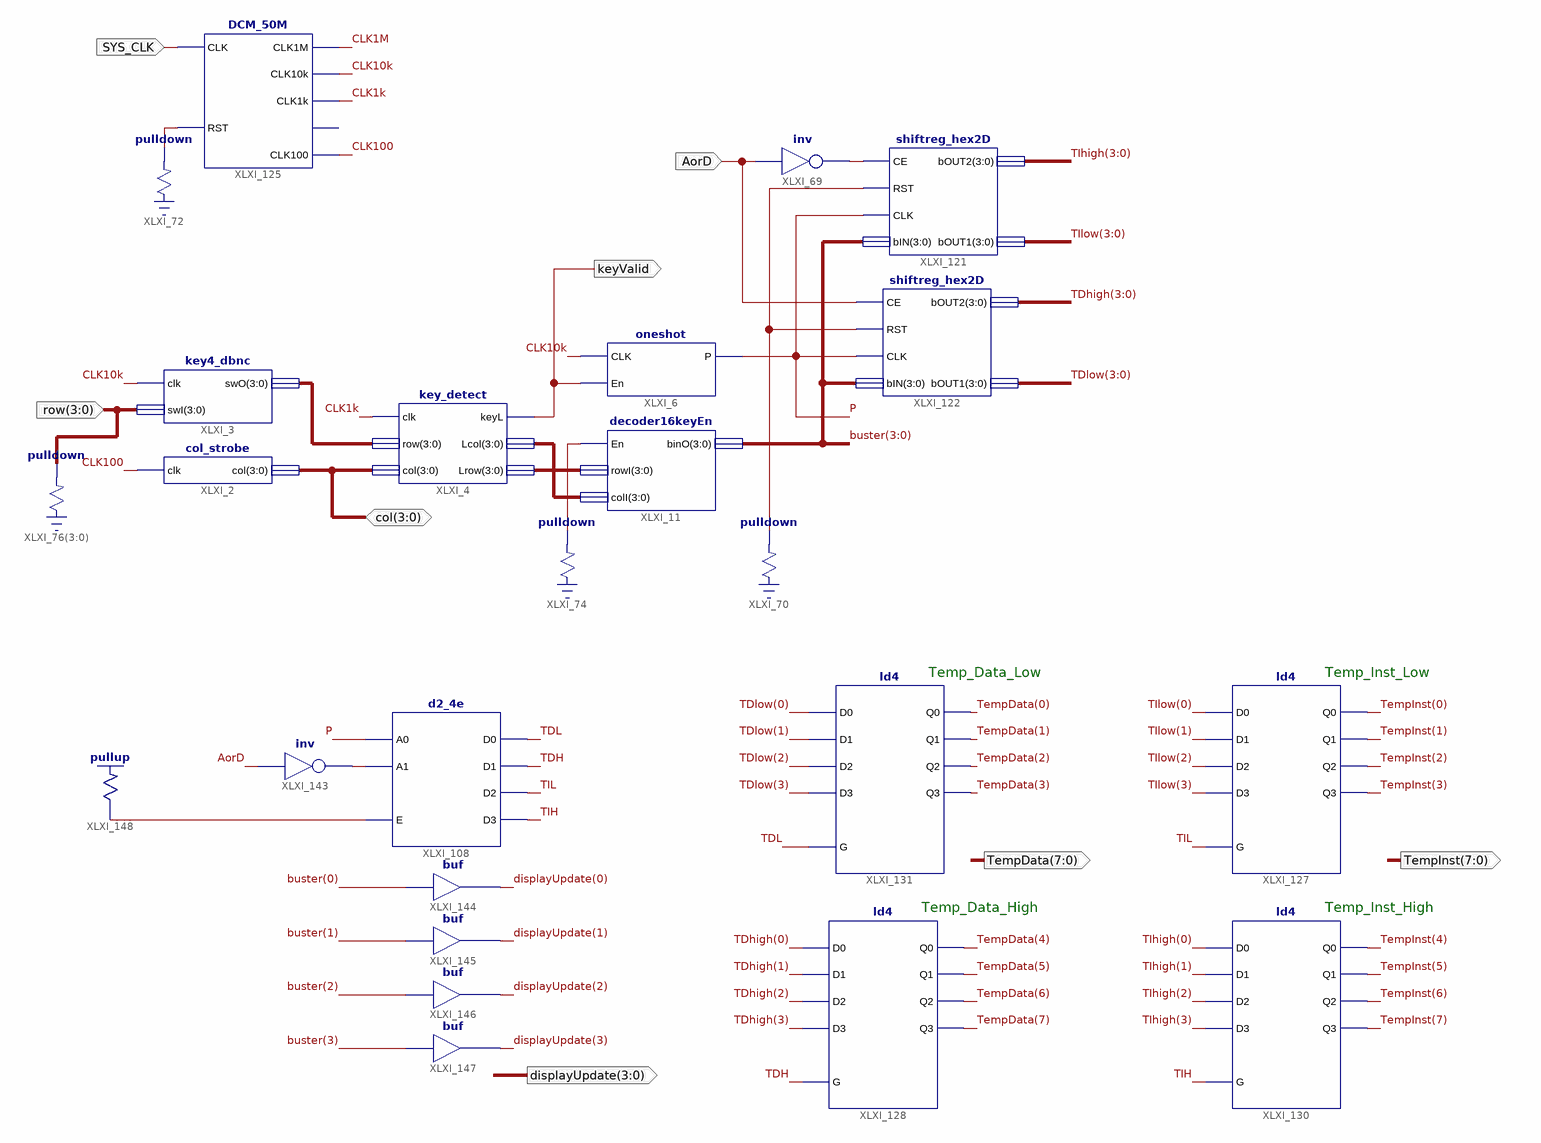
[diagram p0: schematic sheet 1]
// Xilinx ISE schematic KeypadInput.sch (spartan3e) as structural Verilog: 24 symbols, 8 ports
module KeypadInput (
  input  SYS_CLK,
  input  [3:0] row,
  input  AorD,
  inout  [3:0] col,
  output keyValid,
  output [7:0] TempInst,
  output [7:0] TempData,
  output [3:0] displayUpdate
);

  wire CLK1k, CLK1M, CLK10k, CLK100, P, TDH, TDL, TIH, TIL, XLXN_114, XLXN_115, XLXN_128, XLXN_132, XLXN_259,
       XLXN_346;
  wire [3:0] buster, TDhigh, TDlow, TIhigh, TIlow, XLXN_5, XLXN_6, XLXN_170;

  key_detect XLXI_4 (.clk(CLK1k), .row(XLXN_170), .col(col), .keyL(keyValid), .Lcol(XLXN_6), .Lrow(XLXN_5));
  decoder16keyEn XLXI_11 (.En(XLXN_132), .rowI(XLXN_5), .colI(XLXN_6), .binO(buster));
  oneshot XLXI_6 (.CLK(CLK10k), .En(keyValid), .P(P));
  \pulldown  XLXI_74 (.O(XLXN_132));
  key4_dbnc XLXI_3 (.clk(CLK10k), .swI(row), .swO(XLXN_170));
  \pulldown  XLXI_76[3:0] (.O(row));
  col_strobe XLXI_2 (.clk(CLK100), .col(col));
  \pulldown  XLXI_72 (.O(XLXN_128));
  \pulldown  XLXI_70 (.O(XLXN_115));
  not XLXI_69 (XLXN_114, AorD);
  shiftreg_hex2D XLXI_121 (.CE(XLXN_114), .RST(XLXN_115), .CLK(P), .bIN(buster), .bOUT2(TIhigh), .bOUT1(TIlow));
  shiftreg_hex2D XLXI_122 (.CE(AorD), .RST(XLXN_115), .CLK(P), .bIN(buster), .bOUT2(TDhigh), .bOUT1(TDlow));
  DCM_50M XLXI_125 (
    .CLK(SYS_CLK), .RST(XLXN_128), .CLK1M(CLK1M), .CLK10k(CLK10k), .CLK1k(CLK1k), .CLK100(CLK100));  // open: CLK1
  ld4 XLXI_127 (
    .D0(TIlow[0]), .D1(TIlow[1]), .D2(TIlow[2]), .D3(TIlow[3]), .G(TIL), .Q0(TempInst[0]), .Q1(TempInst[1]),
    .Q2(TempInst[2]), .Q3(TempInst[3]));
  ld4 XLXI_130 (
    .D0(TIhigh[0]), .D1(TIhigh[1]), .D2(TIhigh[2]), .D3(TIhigh[3]), .G(TIH), .Q0(TempInst[4]),
    .Q1(TempInst[5]), .Q2(TempInst[6]), .Q3(TempInst[7]));
  ld4 XLXI_128 (
    .D0(TDhigh[0]), .D1(TDhigh[1]), .D2(TDhigh[2]), .D3(TDhigh[3]), .G(TDH), .Q0(TempData[4]),
    .Q1(TempData[5]), .Q2(TempData[6]), .Q3(TempData[7]));
  ld4 XLXI_131 (
    .D0(TDlow[0]), .D1(TDlow[1]), .D2(TDlow[2]), .D3(TDlow[3]), .G(TDL), .Q0(TempData[0]), .Q1(TempData[1]),
    .Q2(TempData[2]), .Q3(TempData[3]));
  d2_4e XLXI_108 (.A0(P), .A1(XLXN_259), .E(XLXN_346), .D0(TDL), .D1(TDH), .D2(TIL), .D3(TIH));
  not XLXI_143 (XLXN_259, AorD);
  buf XLXI_144 (displayUpdate[0], buster[0]);
  buf XLXI_145 (displayUpdate[1], buster[1]);
  buf XLXI_146 (displayUpdate[2], buster[2]);
  buf XLXI_147 (displayUpdate[3], buster[3]);
  \pullup  XLXI_148 (.O(XLXN_346));

  // Notes on the sheet:
  //   Temp_Data_Low
  //   Temp_Inst_Low
  //   Temp_Data_High
  //   Temp_Inst_High
endmodule
